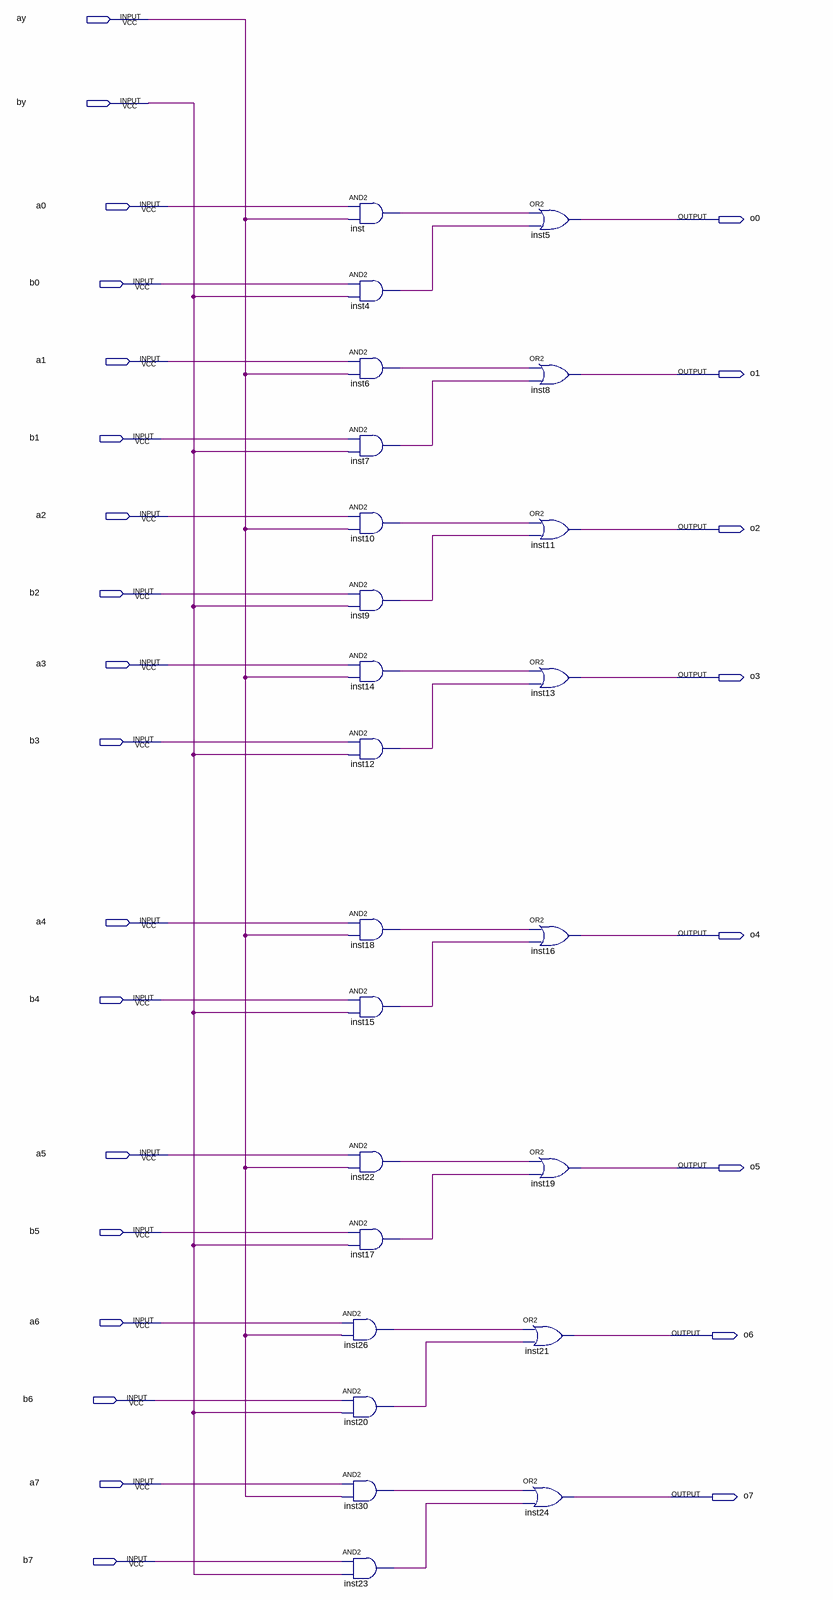
[diagram p0: schematic sheet]
// Quartus schematic 21choose.bdf as structural Verilog: 24 symbols, 26 pins
module \21choose  (
  input  ay,
  input  by,
  input  a0,
  input  b0,
  input  a1,
  input  b1,
  input  a2,
  input  b2,
  input  a3,
  input  b3,
  input  a4,
  input  b4,
  input  a5,
  input  b5,
  input  a6,
  input  b6,
  input  a7,
  input  b7,
  output o0,
  output o1,
  output o2,
  output o3,
  output o4,
  output o5,
  output o6,
  output o7
);

  wire inst4_out, inst6_out, inst7_out, inst9_out, inst10_out, inst12_out, inst14_out, inst15_out,
       inst17_out, inst18_out, inst20_out, inst22_out, inst23_out, inst26_out, inst30_out, inst_out;

  and inst (inst_out, a0, ay);
  and inst4 (inst4_out, b0, by);
  and inst6 (inst6_out, a1, ay);
  and inst7 (inst7_out, b1, by);
  and inst10 (inst10_out, a2, ay);
  and inst9 (inst9_out, b2, by);
  and inst14 (inst14_out, a3, ay);
  and inst12 (inst12_out, b3, by);
  and inst18 (inst18_out, a4, ay);
  and inst15 (inst15_out, b4, by);
  and inst22 (inst22_out, a5, ay);
  and inst17 (inst17_out, b5, by);
  and inst26 (inst26_out, a6, ay);
  and inst20 (inst20_out, b6, by);
  and inst30 (inst30_out, a7, ay);
  and inst23 (inst23_out, b7, by);
  or inst5 (o0, inst_out, inst4_out);
  or inst8 (o1, inst6_out, inst7_out);
  or inst11 (o2, inst10_out, inst9_out);
  or inst13 (o3, inst14_out, inst12_out);
  or inst16 (o4, inst18_out, inst15_out);
  or inst19 (o5, inst22_out, inst17_out);
  or inst21 (o6, inst26_out, inst20_out);
  or inst24 (o7, inst30_out, inst23_out);
endmodule
